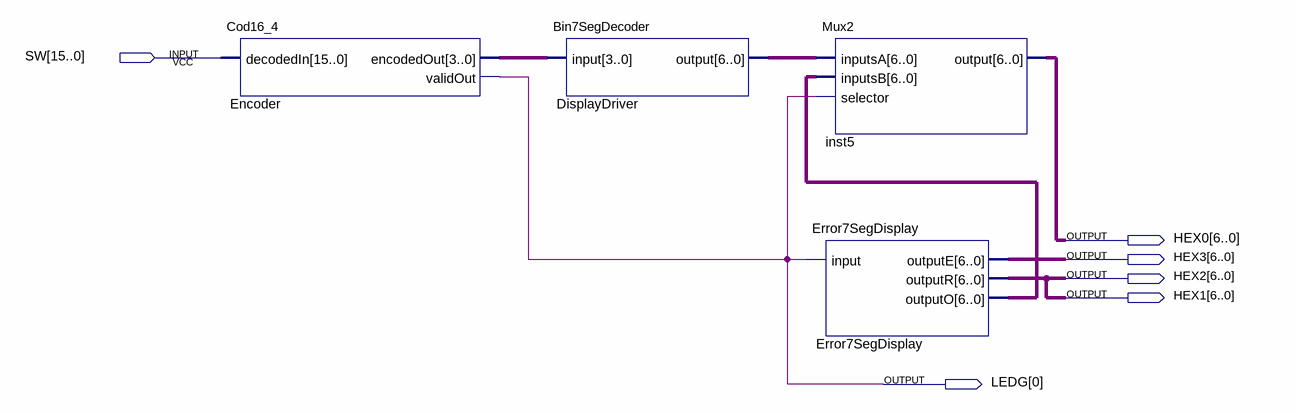
[diagram p0: schematic sheet]
// Quartus schematic Cod16Demo.bdf as structural Verilog: 4 symbols, 6 pins
module Cod16Demo (
  input  [15:0] SW,
  output [6:0] HEX0,
  output [6:0] HEX3,
  output [6:0] HEX2,
  output [6:0] HEX1,
  output [0:0] LEDG
);

  wire [3:0] Encoder_encodedout;
  wire [6:0] DisplayDriver_output, Error7SegDisplay_outputo;

  Cod16_4 Encoder (.decodedIn(SW), .encodedOut(Encoder_encodedout), .validOut(LEDG[0]));
  Bin7SegDecoder DisplayDriver (.\input (Encoder_encodedout), .\output (DisplayDriver_output));
  Mux2 inst5 (.inputsA(DisplayDriver_output), .inputsB(Error7SegDisplay_outputo), .selector(LEDG[0]), .\output (HEX0));
  Error7SegDisplay Error7SegDisplay (
    .\input (LEDG[0]), .outputE(HEX3), .outputR(HEX1), .outputO(Error7SegDisplay_outputo));

  assign HEX2 = HEX1;
endmodule
